# Altium schematic sheet A3_Dott_template_V1.SchDoc
size A3; SheetNumber: 1; SheetTotal: 5
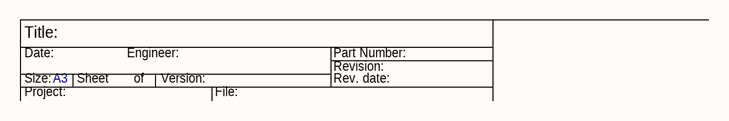
[diagram p0: A3_Dott_template_V1.SchDoc]

## Notes on the sheet
- Title:
- Size:
- Date:
- A3
- Sheet       of
- Engineer:
- Version:
- Part Number:
- Revision:
- Rev. date:
- Project:
- File: